# EasyEDA Pro project 平衡小车.eprj

# Schematic Schematic1
Create Date: 2024-09-21; Page Name: P1; Project Name: 平衡小车; Schematic Name: Schematic1; Update Date: 2024-09-22; Company: 嘉立创EDA; Page Size: A4; Version: V1.0
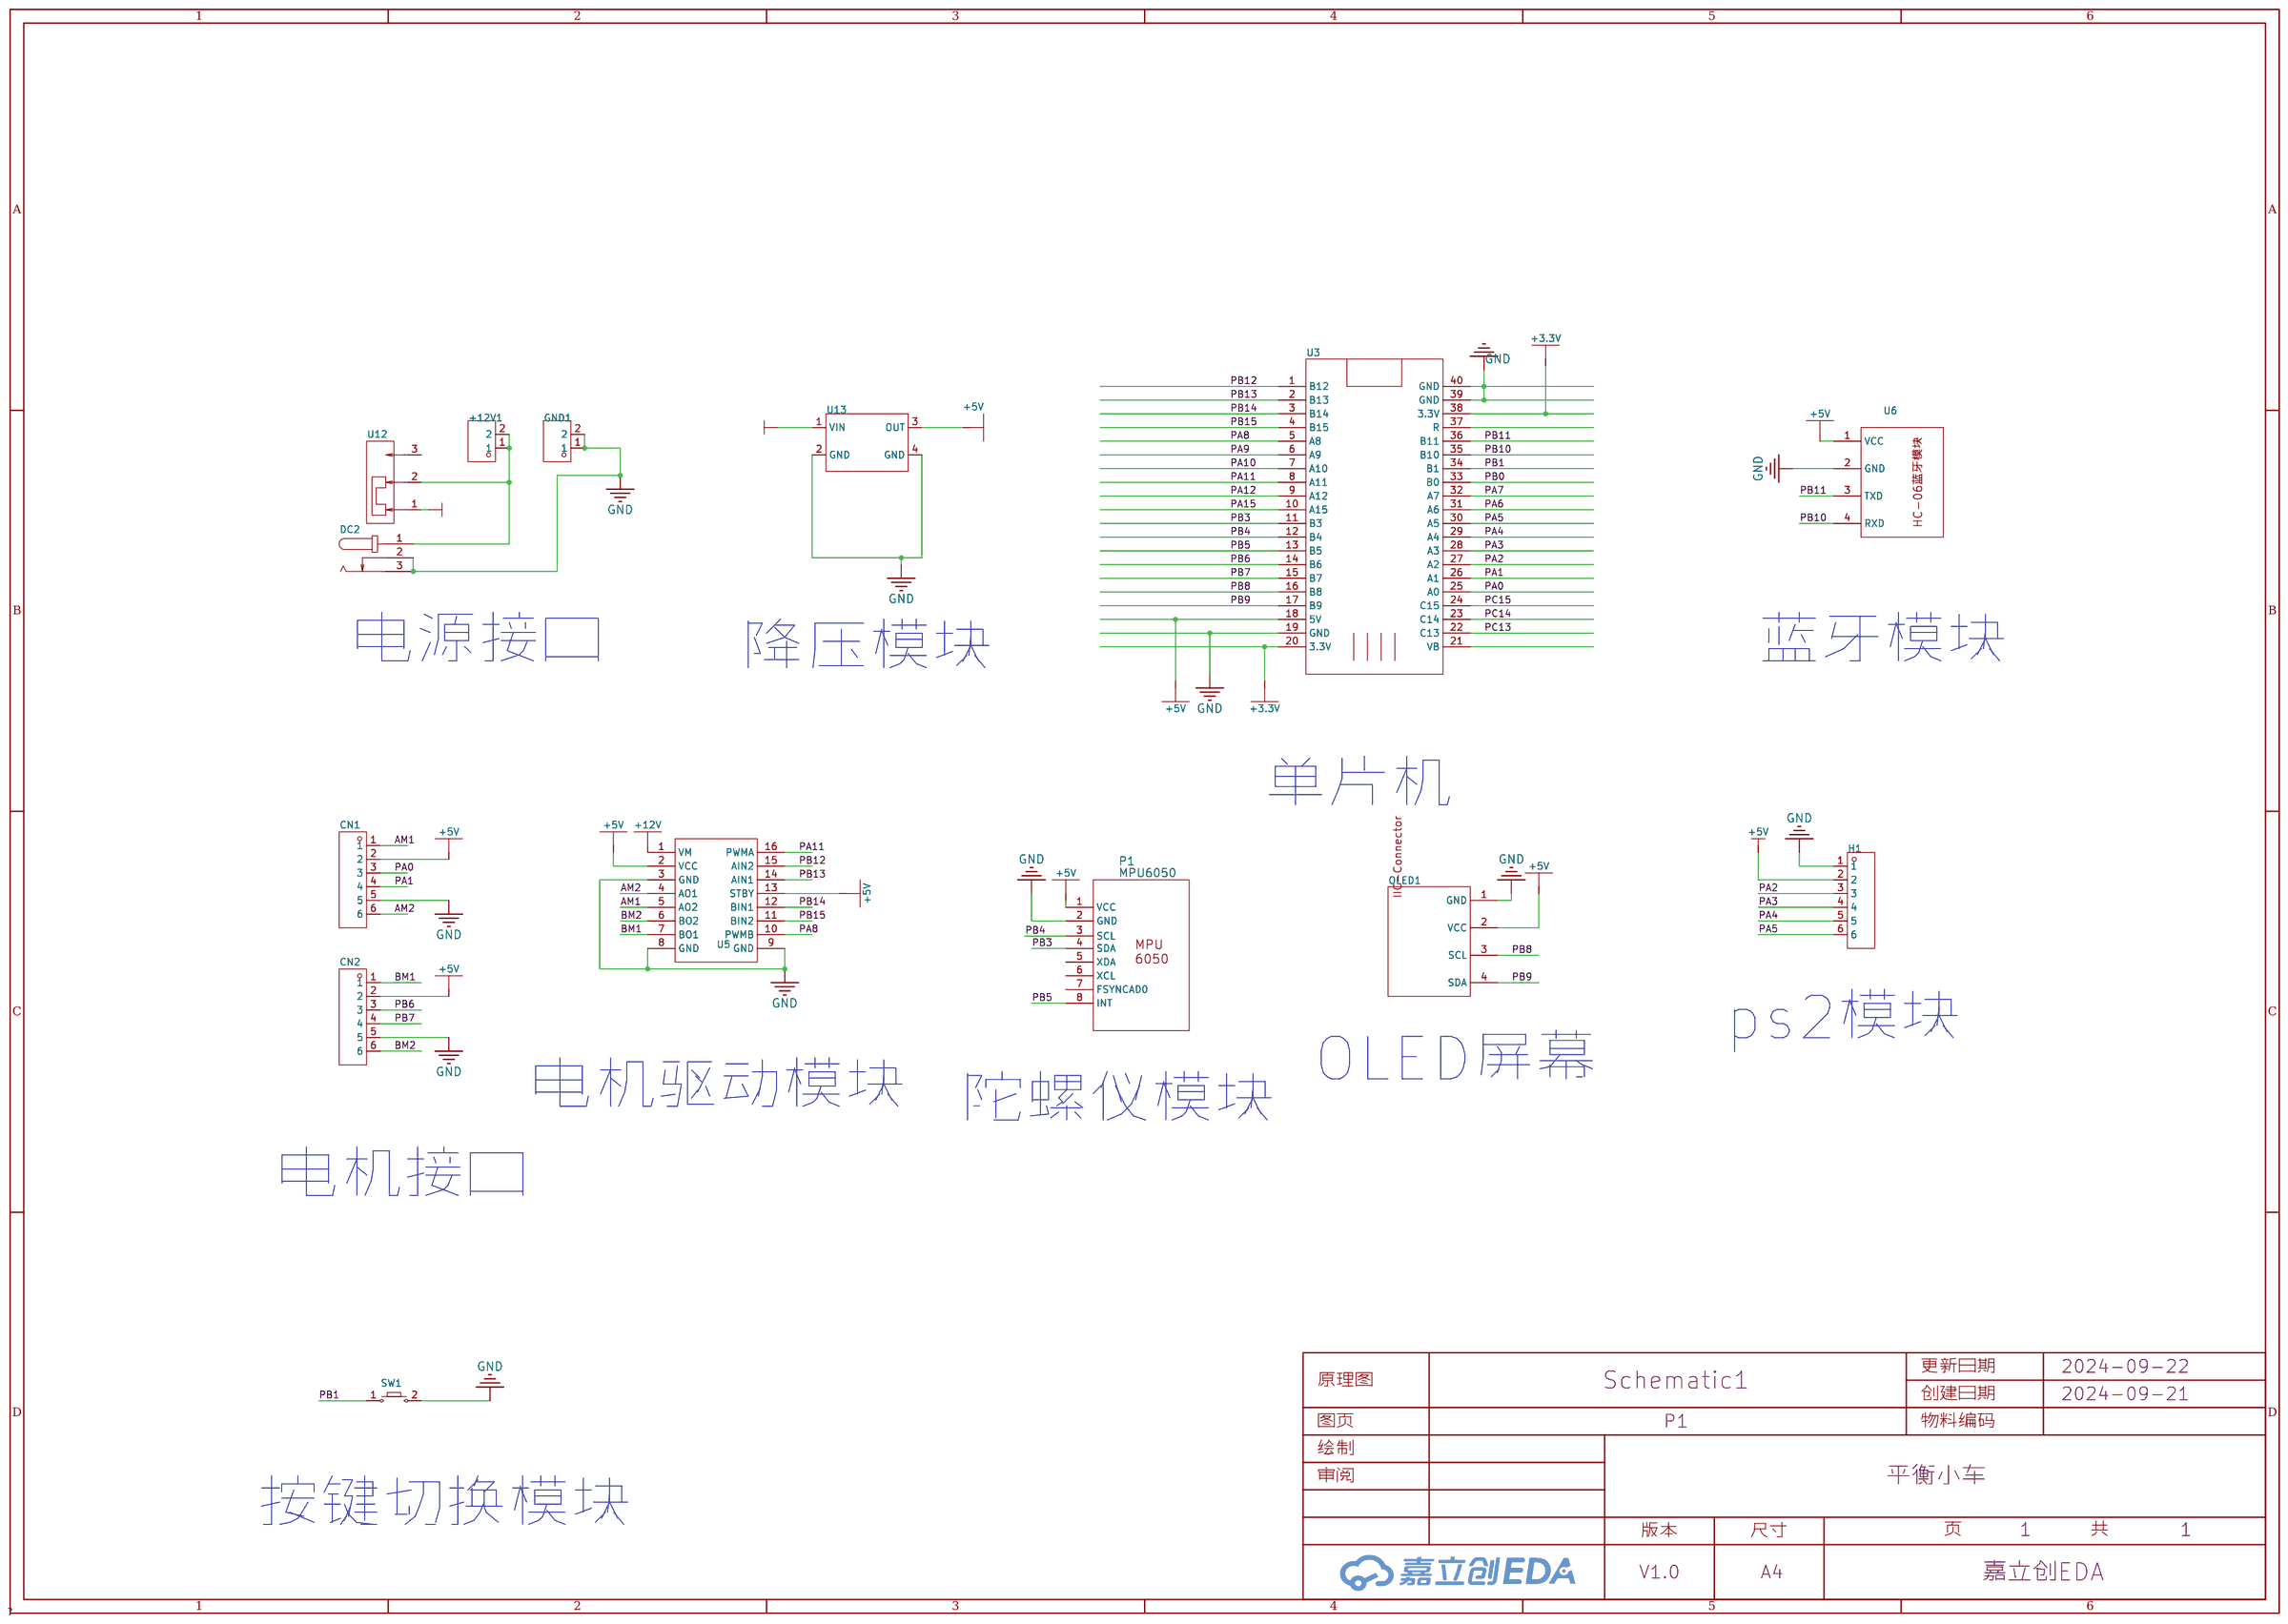
[diagram p0: schematic sheet]

## Parts
+12V1  -  [hdr-th_2p-p2.54-v]
CN1  PH2.0-6P  [ph2.0-6p 直针端子座]
CN2  PH2.0-6P  [ph2.0-6p 直针端子座]
DC2  -  [dc-in-th_kh-dc-005-2.5]
GND1  -  [hdr-th_2p-p2.54-v]
H1  PZ254V-11-06P  [HDR-TH_6P-P2.54-V-M]
OLED1  -  [0.96oled_4p]
P1  MPU6050  [mpu6050]
SW1  -  [Key_SMD_3x4x2]
U3  -  [stm32f103c8t6核心板]
U5  -  [tb6612fng module - 8pin x 2]
U6  蓝牙模块HC-06  [dip-1x4p2.54（hc-06蓝牙模块）]
U12  SS-12D10-G5  [SW-TH_SS-12D10-G050]
U13  -  [MP1584模块]

## Library data of the parts
+12V1 GND1 = 排针2P: 2.54 1*2P 直排针 0.8u镀金 PBT RoHS,针长3*6mm; Supplier Part: C152154; Manufacturer: Nextron(台湾正凌); Manufacturer Part: Z-211-0211-0021-001; LCSC On Sale: 1; Supplier Footprint: Through Hole,P=2.54mm; JLCPCB Part Class: Extended Part; JLCPCB Stock Number: 5280; Datasheet: https://atta.szlcsc.com/upload/public/pdf/source/20171225/C152154_15141883746031203216.pdf; Supplier: LCSC; Number of Positions: 2; Connector Type: 排针; Number of Rows: 1; Mounting Type: 通孔; Contact Type: 公形引脚; Pitch: 0.100; Contact Material: 黄铜
CN1 CN2 = PH2.0-6P: Pin Type: IN; Supplier: LCSC; Supplier Part: C722763; Manufacturer: CAX(创都); Manufacturer Part: PH2.0-4P; JLCPCB Part Class: Extended Part
DC2 = KH-DC-005-2.5: 连接器类型:DC电源插座;安装方式:弯插;触点内径:-;触点外径:6.4mm;额定电流:1A;额定电压:30V;工作温度范围:-25~+70;; LCSC Part Name: DC电源插座 外径:6.4mm; Supplier Part: C2847170; Manufacturer: kinghelm(金航标); Supplier Footprint: 插件; JLCPCB Part Class: Extended Part; Datasheet: https://atta.szlcsc.com/upload/public/pdf/source/20210716/C2847170_7F0110A0BEDEE81C68B76DF87AC8DA16.pdf; Supplier: LCSC; Connector Type: DC电源插座; Mounting Style: 弯插; Outside Contact Diameter: 6.4mm; Current Rating (Max): 1A; Voltage Rating (Max): 30V; Operating Temperature Range: -25~+70
H1 = PZ254V-11-06P: 插针结构:1x6P;间距:2.54mm;行距:-;圆针/方针:方针;安装类型:直插;排数:单排;总PIN位数:6P;额定电流:-;额定电压:-;配合针长度:6mm;塑高:2.5mm;端接针长度:3mm;触头材质:黄铜;触头镀层:-;工作温度范围:-40℃~+105℃;颜色:黑色;; LCSC Part Name: 间距:2.54mm 1x6P 直插 方针; Supplier Part: C492405; Manufacturer: XFCN(兴飞); Supplier Footprint: 插件,P=2.54mm; JLCPCB Part Class: 扩展库; Datasheet: https://atta.szlcsc.com/upload/public/pdf/source/20200309/C492405_597F1930F5B55CC3C7FD95458F1C3977.pdf; Supplier: LCSC; Pin Structure: 1x6P; Pitch: 2.54mm; Circluar Pins/Square Pins: 方针; Mounting Type: 直插; Number of Rows: 单排; Number of Pins: 6P; Length of Mating Pin: 6mm; Insulation Height: 2.5mm; Length of End Connection Pin: 3mm; Contact Material: 黄铜; Operating Temperature Range: -40℃~+105℃; Color: 黑色
OLED1 = 0.96OLED_4P: LCSC Part Name: 0.96OLED_4P_MODULE_JX; Supplier Part: C9900004566; Manufacturer Part: 0.96OLED_4P_MODULE_JX; Supplier Footprint: THrough hole; JLCPCB Part Class: Extended Part; Supplier: LCSC
P1 = MPU6050
SW1 = Key_SMD_3x4x2: Supplier Footprint: SMD
U3 = stm32f103c8t6最小系统板
U5 = TB6612FNG模块: Pin Type: In
U6 = 蓝牙模块HC-06: Pin Type: IN
U12 = SS-12D10-G5: 电路结构:单刀双掷;安装方式:直插;开关颜色:黑色;滑钮形状:矩形柱状;引脚样式:PC引脚;开关长度:12.7mm;开关宽度:6.7mm;开关高度:11.3mm;; LCSC Part Name: 插件大电流拨动开关; Supplier Part: C2998777; Manufacturer: DEALON(德艺隆); Supplier Footprint: 插件; JLCPCB Part Class: Extended Part; Datasheet: https://atta.szlcsc.com/upload/public/pdf/source/20220428/E10CB334ACBAF32CF4AF8D87DA871CD3.pdf; Supplier: LCSC; Circuit: 单刀双掷; Mounting Style: 直插; Actuator Color: 黑色; Actuator Style: 矩形柱状; Pin Style: PC引脚; Switch Length: 12.7mm; Switch Width: 6.7mm; Switch Height: 11.3mm
U13 = MP1584模块: Pin Type: IN

## Nets
+3.3V: U3.20(3.3V) U3.38(3.3V)
+5V: CN1.2 CN2.2 H1.2 OLED1.2(VCC) P1.1(VCC) U3.18(5V) U5.2(VCC) U5.13(STBY) U6.1(VCC) U13.3(OUT)
+12V: U5.1(VM) U12.1 U13.1(VIN)
GND: CN1.5 CN2.5 DC2.2 DC2.3 GND1.1 GND1.2 H1.1 OLED1.1(GND) P1.2(GND) SW1.2 U3.19(GND) U3.39(GND) U3.40(GND) U5.3(GND) U5.8(GND) U5.9(GND) U6.2(GND) U13.2(GND) U13.4(GND)
AM1: CN1.1 U5.5(AO2)
AM2: CN1.6 U5.4(AO1)
BM1: CN2.1 U5.7(BO1)
BM2: CN2.6 U5.6(BO2)
PA0: CN1.3 U3.25(A0)
PA1: CN1.4 U3.26(A1)
PA2: H1.3 U3.27(A2)
PA3: H1.4 U3.28(A3)
PA4: H1.5 U3.29(A4)
PA5: H1.6 U3.30(A5)
PA6: U3.31(A6)
PA7: U3.32(A7)
PA8: U3.5(A8) U5.10(PWMB)
PA9: U3.6(A9)
PA10: U3.7(A10)
PA11: U3.8(A11) U5.16(PWMA)
PA12: U3.9(A12)
PA15: U3.10(A15)
PB0: U3.33(B0)
PB1: SW1.1 U3.34(B1)
PB3: P1.4(SDA) U3.11(B3)
PB4: P1.3(SCL) U3.12(B4)
PB5: P1.8(INT) U3.13(B5)
PB6: CN2.3 U3.14(B6)
PB7: CN2.4 U3.15(B7)
PB8: OLED1.3(SCL) U3.16(B8)
PB9: OLED1.4(SDA) U3.17(B9)
PB10: U3.35(B10) U6.4(RXD)
PB11: U3.36(B11) U6.3(TXD)
PB12: U3.1(B12) U5.15(AIN2)
PB13: U3.2(B13) U5.14(AIN1)
PB14: U3.3(B14) U5.12(BIN1)
PB15: U3.4(B15) U5.11(BIN2)
PC13: U3.22(C13)
PC14: U3.23(C14)
PC15: U3.24(C15)
$1N933: +12V1.1 +12V1.2 DC2.1 U12.2

Not connected (* = marked no-connect by the designer): P1 5(XDA) 6(XCL) 7(FSYNCAD0); U3 21(VB) 37(R); U12 3

## Notes on the sheet
- 电源接口
- 降压模块
- 蓝牙模块
- 单片机
- ps2模块
- OLED屏幕
- 电机驱动模块
- 陀螺仪模块
- 电机接口
- 按键切换模块

# Board PCB1
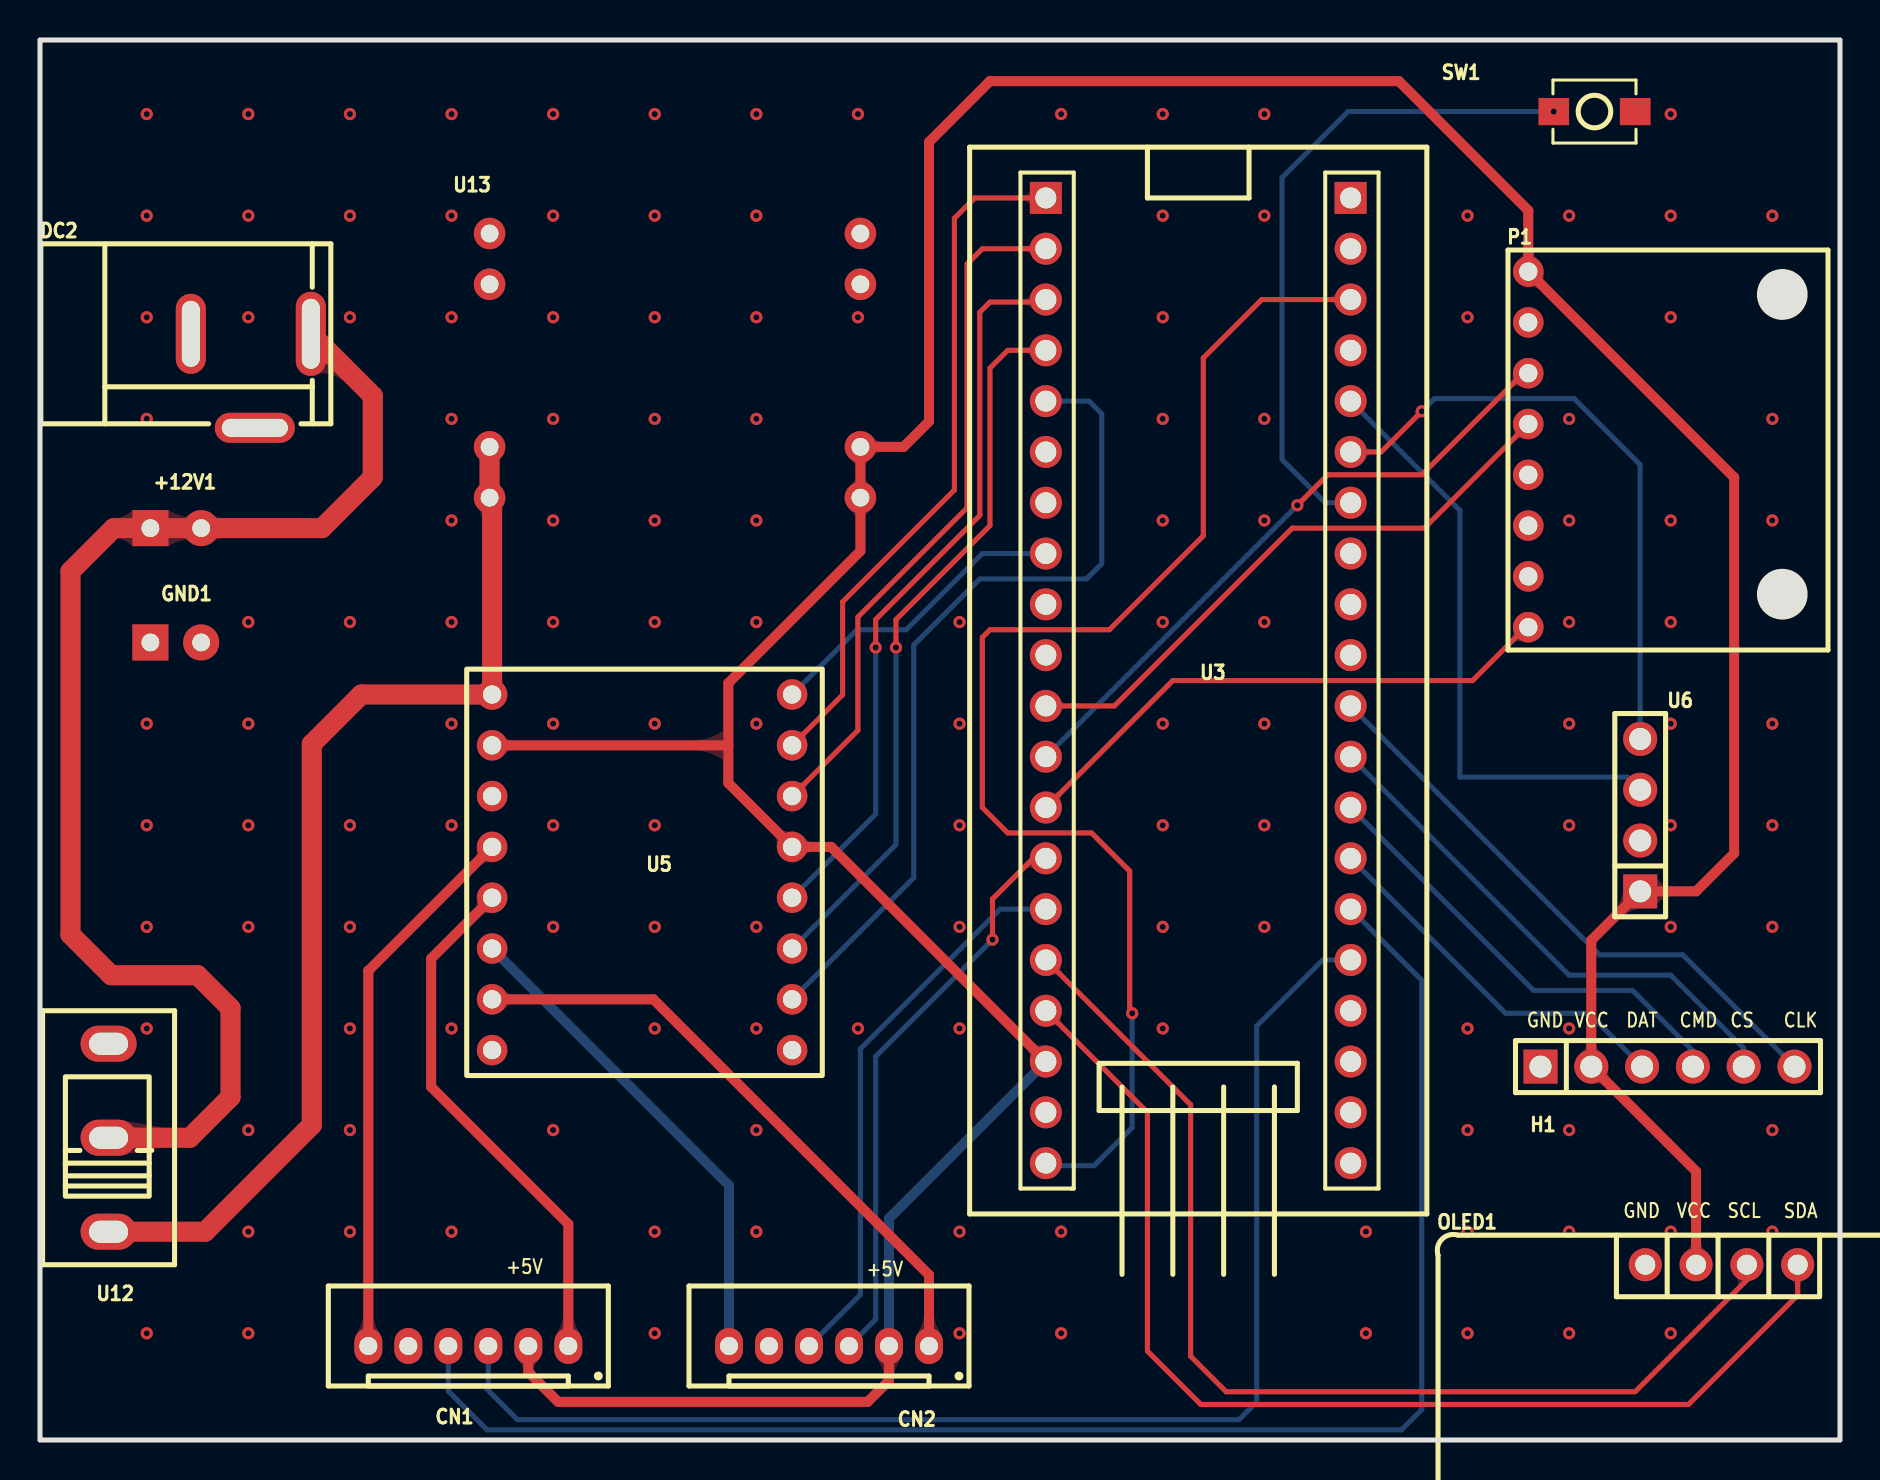
[diagram p1: board, top side]
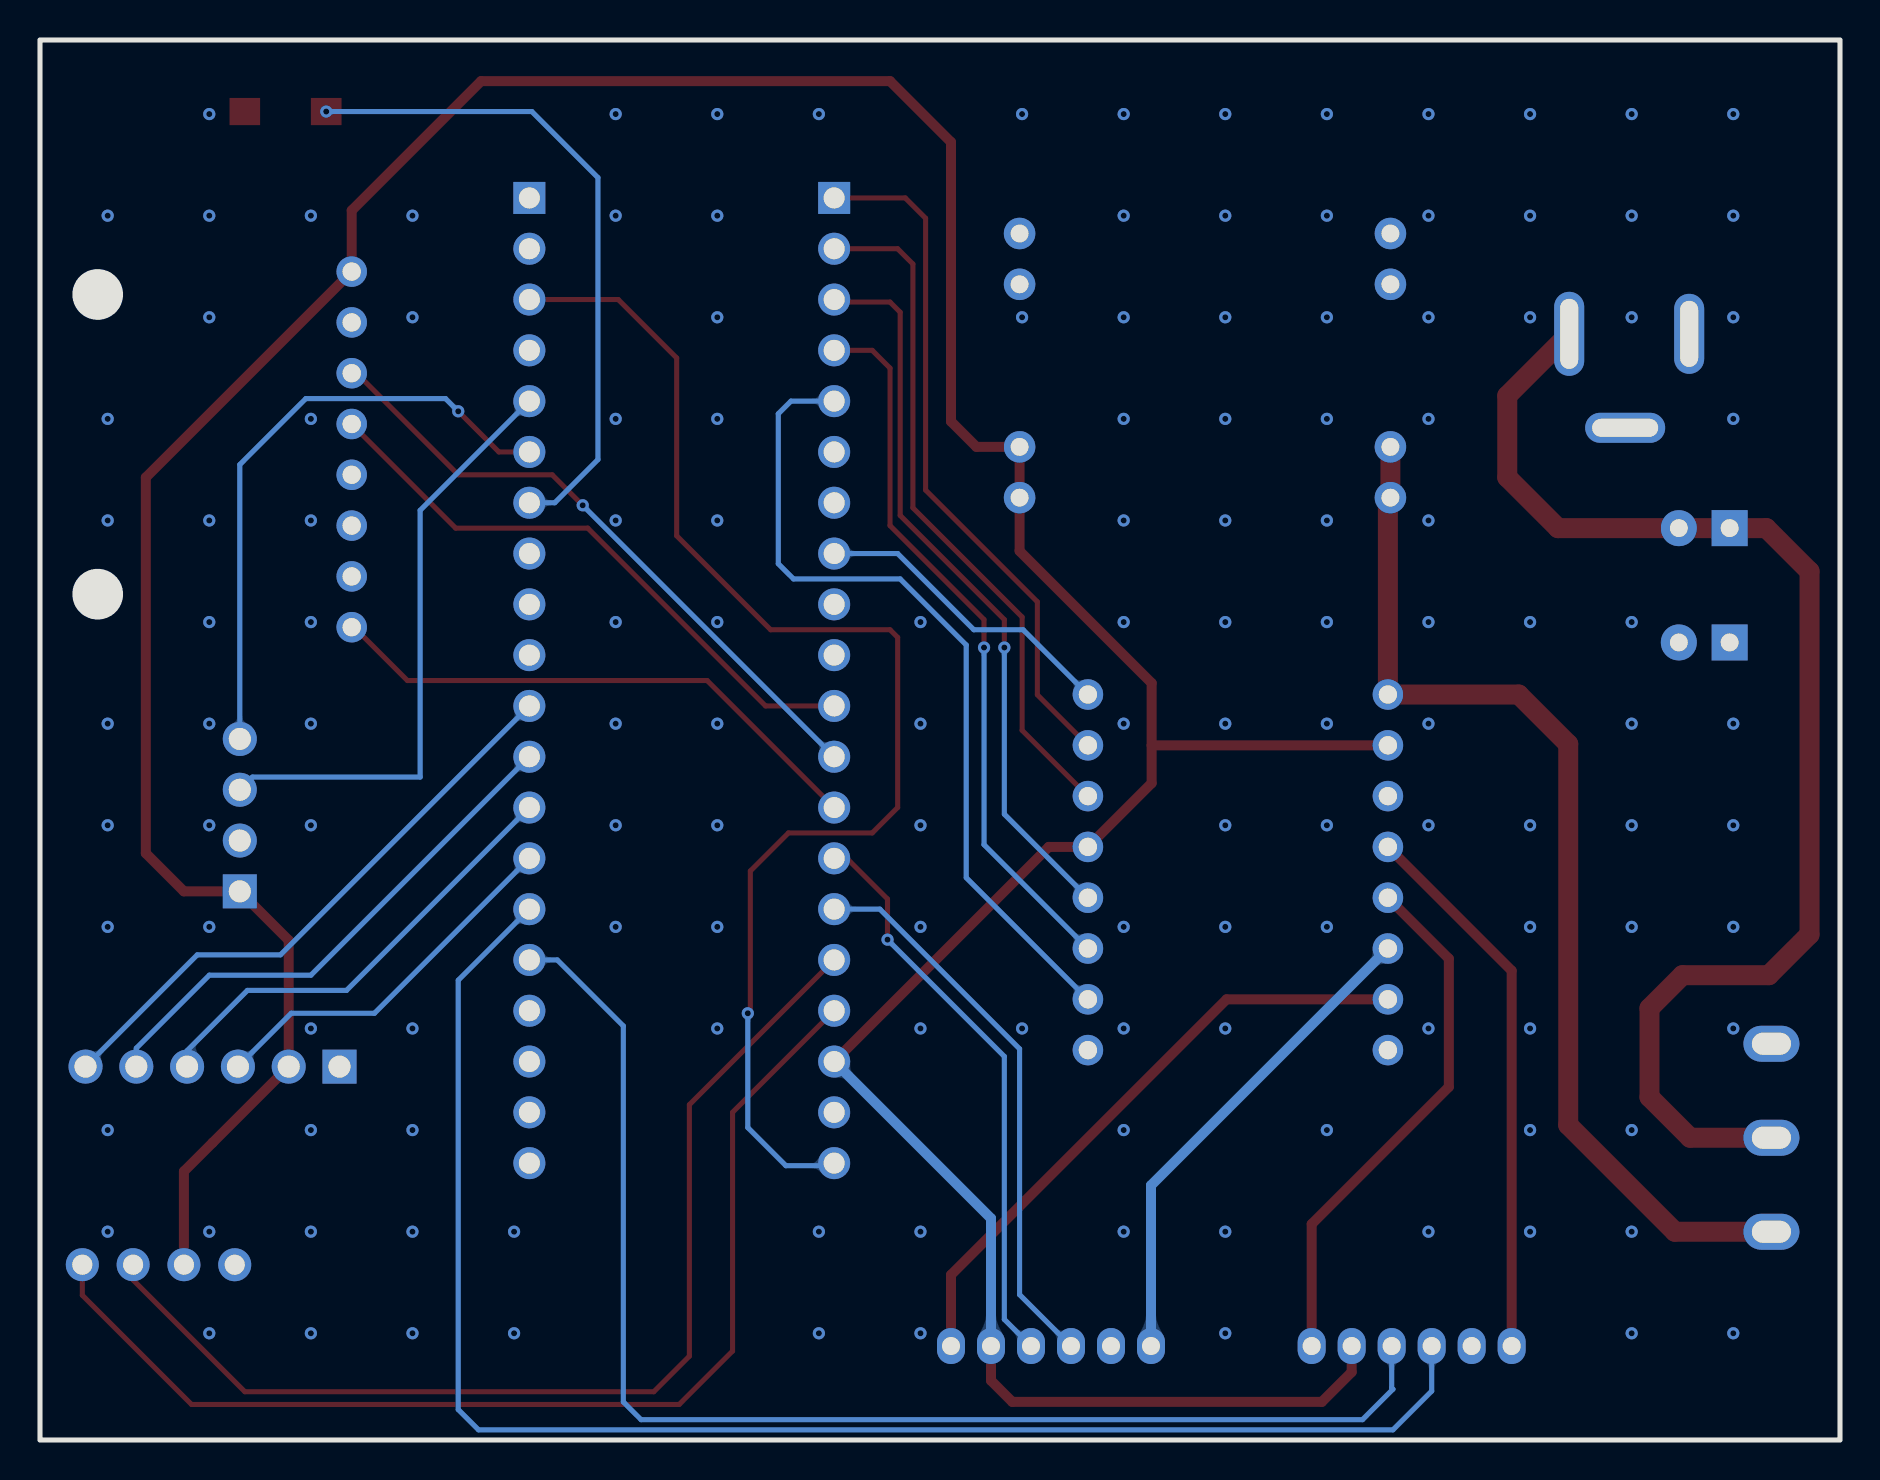
[diagram p2: board, bottom side, seen from below]

Outline 90 x 70 mm; copper layers: Top Layer, Bottom Layer. Coordinates in mm from the lower left corner of the outline.
Outline path: rectangle 0,70 90,0
Stack: Top Layer 0.035mm / Dielectric1 1.51mm FR4 er 4.5 / Bottom Layer 0.035mm

## Design rules (mm)
template: JLCPCB Capability(Two Layers Board)
spacing copperThickness1oz (default): track to track 0.102, other pairs 0.152 to 0.3
spacing copperThickness2oz: track to track 0.203, other pairs 0.152 to 0.3
track width copperThickness1oz (default): min 0.127, default 0.254, max 2.54
track width copperThickness2oz: min 0.203, default 0.254, max 2.54
differential pair differentialPair (default): width min 0.127, default 0.254, max 2.54; gap min 0.152, default 0.152
via viaSize (default): diameter min 0.5, default 0.61, max 10; hole min 0.3, default 0.305, max 6.3

## Placement (name value [footprint] x y rotation side)
+12V1  -  [hdr-th_2p-p2.54-v]  6.79 45.59 0 top
CN1  PH2.0-6P  [ph2.0-6p 直针端子座]  26.42 4.7 180 top
CN2  PH2.0-6P  [ph2.0-6p 直针端子座]  44.45 4.7 180 top
DC2  -  [dc-in-th_kh-dc-005-2.5]  10.54 52.96 0 top
GND1  -  [hdr-th_2p-p2.54-v]  6.79 39.88 0 top
H1  PZ254V-11-06P  [HDR-TH_6P-P2.54-V-M]  81.38 18.67 0 top
OLED1  -  [0.96oled_4p]  84.07 8.76 0 top
P1  MPU6050  [mpu6050]  73.4 39.5 0 top
SW1  -  [Key_SMD_3x4x2]  77.72 66.42 0 top
U3  -  [stm32f103c8t6核心板]  57.91 37.97 0 top
U5  -  [tb6612fng module - 8pin x 2]  30.22 28.38 0 top
U6  蓝牙模块HC-06  [dip-1x4p2.54（hc-06蓝牙模块）]  80.01 31.24 0 top
U12  SS-12D10-G5  [SW-TH_SS-12D10-G050]  3.43 15.11 90 top
U13  -  [MP1584模块]  31.75 53.72 0 top

## Footprints (pads in the part's own frame, mm; a bottom-side part is the same pattern mirrored in y, then rotated)
0.96oled_4p
  round 1.651 hole 1.001: 1(-3.81,0) 2(-1.27,0.003) 3(1.27,0.003) 4(3.81,0.003)
dc-in-th_kh-dc-005-2.5
  oval 1.501x4.201 hole 0.899x3.5: 1(2.999,2.349)
  oval 1.501x4 hole 0.899x3.3: 2(-2.999,2.349)
  oval 4x1.501 hole 3.3x0.899: 3(0.201,-2.349)
dip-1x4p2.54（hc-06蓝牙模块）
  rect 1.7x1.7 hole 1.1: 1(0,-3.81)
  round 1.7 hole 1.1: 2(0,-1.27) 3(0,1.27) 4(0,3.81)
hdr-th_2p-p2.54-v
  rect 1.801x1.801 hole 0.889: 1(-1.27,0)
  round 1.801 hole 0.889: 2(1.27,0)
HDR-TH_6P-P2.54-V-M
  rect 1.7x1.7 hole 1.1: 1(-6.35,0)
  round 1.7 hole 1.1: 2(-3.81,0) 3(-1.27,0) 4(1.27,0) 5(3.81,0) 6(6.35,0)
Key_SMD_3x4x2
  rect 1.53x1.36 smd: 1(-2.035,0) 2(2.035,0)
MP1584模块
  round 1.575 hole 0.889: 1(-9.271,-4.064) 1(-9.271,-6.604) 2(-9.271,6.604) 2(-9.271,4.064) 3(9.271,-4.064) 3(9.271,-6.604) 4(9.271,6.604) 4(9.271,4.064)
mpu6050
  round 1.524 hole 0.914: 1(1.016,18.923) 2(1.016,16.383) 3(1.016,13.843) 4(1.016,11.303) 5(1.016,8.763) 6(1.016,6.223) 7(1.016,3.683) 8(1.016,1.143)
ph2.0-6p 直针端子座
  oval 1.4x1.8 hole 0.9: 1(0,0) 2(2,0) 3(4,0) 4(6,0) 5(8,0) 6(10,0)
stm32f103c8t6核心板
  rect 1.6x1.6 hole 1.049: 1(-7.62,24.13) 40(7.62,24.13)
  round 1.6 hole 1.049: 2(-7.62,21.59) 3(-7.62,19.05) 4(-7.62,16.51) 5(-7.62,13.97) 6(-7.62,11.43) 7(-7.62,8.89) 8(-7.62,6.35) 9(-7.62,3.81) 10(-7.62,1.27) 11(-7.62,-1.27) 12(-7.62,-3.81) 13(-7.62,-6.35) 14(-7.62,-8.89) 15(-7.62,-11.43) 16(-7.62,-13.97) 17(-7.62,-16.51) 18(-7.62,-19.05) 19(-7.62,-21.59) 20(-7.62,-24.13) 21(7.62,-24.13) 22(7.62,-21.59) 23(7.62,-19.05) 24(7.62,-16.51) 25(7.62,-13.97) 26(7.62,-11.43) 27(7.62,-8.89) 28(7.62,-6.35) 29(7.62,-3.81) 30(7.62,-1.27) 31(7.62,1.27) 32(7.62,3.81) 33(7.62,6.35) 34(7.62,8.89) 35(7.62,11.43) 36(7.62,13.97) 37(7.62,16.51) 38(7.62,19.05) 39(7.62,21.59)
SW-TH_SS-12D10-G050
  oval 1.8x2.8 hole 1.1x1.95: 1(-4.7,0) 2(0,0) 3(4.7,0)
tb6612fng module - 8pin x 2
  round 1.524 hole 0.914: 1(-7.62,8.89) 2(-7.62,6.35) 3(-7.62,3.81) 4(-7.62,1.27) 5(-7.62,-1.27) 6(-7.62,-3.81) 7(-7.62,-6.35) 8(-7.62,-8.89) 9(7.38,-8.89) 10(7.38,-6.35) 11(7.38,-3.81) 12(7.38,-1.27) 13(7.38,1.27) 14(7.38,3.81) 15(7.38,6.35) 16(7.38,8.89)

## Nets
As in the schematic.

Pads without a net: P1 5 6 7; U12 3

## Via types
v1: diameter 0.61, hole 0.305, Top Layer to Bottom Layer, 7 vias
v2: diameter 0.61, hole 0.304, Top Layer to Bottom Layer, 138 vias

## Routing (per net, layer and track width the routed paths; a pad name or vN(x,y) marks a point on that pad's centre or on a via; arc(x,y) is an arc through that point)
+3.3V: length 65.8
  Top Layer w0.254: U3.38 61.09,57.02 58.17,54.1 58.17,45.21 53.47,40.51 47.5,40.51 47.12,40.13 47.12,31.62 48.39,30.35 52.58,30.35 54.48,28.45 54.48,21.46 v1(54.61,21.34)
  Bottom Layer w0.254: v1(54.61,21.34) 54.61,15.62 52.71,13.72 50.42,13.72 U3.20
+5V: length 208.2
  Top Layer w0.5: U3.18 39.56,29.65 U5.13 34.42,32.84 34.42,34.73 ; 34.42,34.73 U5.2 ; 34.42,34.73 34.42,37.85 41.02,44.45 41.02,49.66 43.18,49.66 44.45,50.93 44.45,64.9 47.5,67.94 67.94,67.94 74.41,61.47 P1.1 84.71,48.13 84.71,29.34 82.8,27.43 U6.1 77.56,24.99 H1.2 82.8,13.43 OLED1.2 ; CN1.2 24.42,3.4 25.91,1.91 41.38,1.91 42.45,2.97 CN2.2
  Bottom Layer w0.5: U3.18 42.45,11.08 CN2.2
+12V: length 53.9
  Top Layer w1: 22.48,49.66 U13.1 22.61,46.99 U5.1 16.07,37.27 13.59,34.8 13.59,15.75 8.25,10.41 U12.1
GND:
  vias: v2(5.34,66.3) v2(5.34,61.22) v2(5.34,56.14) v2(5.34,51.06) v2(5.34,35.82) v2(5.34,30.74) v2(5.34,25.66) v2(5.34,20.58) v2(5.34,5.34) v2(10.42,66.3) v2(10.42,61.22) v2(10.42,56.14) v2(10.42,40.9) v2(10.42,35.82) v2(10.42,30.74) v2(10.42,25.66) v2(10.42,15.5) v2(10.42,10.42) v2(10.42,5.34) v2(15.5,66.3) v2(15.5,61.22) v2(15.5,56.14) v2(15.5,40.9) v2(15.5,30.74) v2(15.5,25.66) v2(15.5,20.58) v2(15.5,15.5) v2(15.5,10.42) v2(20.58,66.3) v2(20.58,61.22) v2(20.58,56.14) v2(20.58,51.06) v2(20.58,45.98) v2(20.58,40.9) v2(20.58,35.82) v2(20.58,30.74) v2(20.58,20.58) v2(20.58,10.42) v2(25.66,66.3) v2(25.66,61.22) v2(25.66,56.14) v2(25.66,51.06) v2(25.66,45.98) v2(25.66,40.9) v2(25.66,35.82) v2(25.66,30.74) v2(25.66,25.66) v2(25.66,15.5) v2(30.74,66.3) v2(30.74,61.22) v2(30.74,56.14) v2(30.74,51.06) v2(30.74,45.98) v2(30.74,40.9) v2(30.74,35.82) v2(30.74,30.74) v2(30.74,25.66) v2(30.74,20.58) v2(30.74,10.42) v2(30.74,5.34) v2(35.82,66.3) v2(35.82,61.22) v2(35.82,56.14) v2(35.82,51.06) v2(35.82,45.98) v2(35.82,40.9) v2(35.82,35.82) v2(35.82,25.66) v2(35.82,20.58) v2(35.82,15.5) v2(35.82,10.42) v2(40.9,66.3) v2(40.9,56.14) v2(40.9,20.58) v2(45.98,40.9) v2(45.98,35.82) v2(45.98,30.74) v2(45.98,25.66) v2(45.98,20.58) v2(45.98,10.42) v2(45.98,5.34) v2(51.06,66.3) v2(51.06,10.42) v2(51.06,5.34) v2(56.14,66.3) v2(56.14,61.22) v2(56.14,56.14) v2(56.14,51.06) v2(56.14,45.98) v2(56.14,40.9) v2(56.14,35.82) v2(56.14,30.74) v2(56.14,25.66) v2(56.14,20.58) v2(61.22,66.3) v2(61.22,61.22) v2(61.22,51.06) v2(61.22,45.98) v2(61.22,40.9) v2(61.22,35.82) v2(61.22,30.74) v2(61.22,25.66) v2(66.3,10.42) v2(66.3,5.34) v2(71.38,61.22) v2(71.38,56.14) v2(71.38,20.58) v2(71.38,15.5) v2(71.38,10.42) v2(71.38,5.34) v2(76.46,61.22) v2(76.46,51.06) v2(76.46,45.98) v2(76.46,40.9) v2(76.46,35.82) v2(76.46,30.74) v2(76.46,20.58) v2(76.46,15.5) v2(76.46,10.42) v2(76.46,5.34) v2(81.54,66.3) v2(81.54,61.22) v2(81.54,56.14) v2(81.54,45.98) v2(81.54,40.9) v2(81.54,35.82) v2(81.54,30.74) v2(81.54,25.66) v2(81.54,10.42) v2(81.54,5.34) v2(86.62,61.22) v2(86.62,51.06) v2(86.62,45.98) v2(86.62,35.82) v2(86.62,30.74) v2(86.62,25.66) v2(86.62,15.5) v2(86.62,10.42)
AM1: length 26.5
  Top Layer w0.5: CN1.1 26.42,10.79 19.56,17.65 19.56,24.07 U5.5
AM2: length 27.5
  Top Layer w0.5: CN1.6 16.42,23.47 U5.4
BM1: length 31.1
  Top Layer w0.5: U5.7 30.67,22.03 44.45,8.25 CN2.1
BM2: length 24.8
  Bottom Layer w0.5: U5.6 34.45,12.73 CN2.6
PA0: length 66.5
  Bottom Layer w0.254: U3.25 64.13,24 60.83,20.7 60.83,1.91 59.94,1.02 23.88,1.02 22.35,2.54 22.42,2.6 CN1.3
PA1: length 78.6
  Bottom Layer w0.254: CN1.4 20.42,2.44 22.35,0.51 68.07,0.51 69.09,1.52 69.09,22.99 U3.26
PA2: length 18.9
  Bottom Layer w0.254: U3.27 73.28,21.34 77.44,21.34 H1.3
PA3: length 22.9
  Bottom Layer w0.254: H1.4 82.65,19.46 79.63,22.48 74.68,22.48 U3.28
PA4: length 26.6
  Bottom Layer w0.254: U3.29 76.45,23.24 81.53,23.24 85.19,19.59 H1.5
PA5: length 29.7
  Bottom Layer w0.254: H1.6 82.14,24.26 77.98,24.26 U3.30
PA8: length 41.9
  Bottom Layer w0.254: U5.10 43.69,28.12 43.69,39.75 46.99,43.05 52.32,43.05 53.09,43.81 53.09,51.31 52.45,51.94 U3.5
PA11: length 15.6
  Bottom Layer w0.254: U5.16 40.84,40.51 43.31,40.51 47.12,44.32 U3.8
PB1: length 33.4
  Bottom Layer w0.254: U3.34 64.26,46.86 62.1,49.02 62.1,63.12 65.41,66.42 v1(75.69,66.42)
PB3: length 30.3
  Top Layer w0.254: 74.68,51.05 69.22,45.59 62.61,45.59 53.72,36.7 U3.11
PB4: length 32.1
  Top Layer w0.254: P1.3 74.17,53.34 69.09,48.26 64.39,48.26 v1(62.87,46.74)
  Bottom Layer w0.254: U3.12 v1(62.87,46.74)
PB5: length 27.9
  Top Layer w0.254: U3.13 56.64,37.97 71.63,37.97 74.29,40.64 P1.8
PB6: length 28.8
  Top Layer w0.254: v1(47.62,25.02) 47.62,27.05 49.66,29.08 U3.14
  Bottom Layer w0.254: v1(47.62,25.02) 41.78,19.18 41.78,6.03 CN2.3
PB7: length 28.1
  Bottom Layer w0.254: CN2.4 41.02,7.27 41.02,19.56 48.01,26.54 U3.15
PB8: length 54.4
  Top Layer w0.254: U3.16 57.53,16.76 57.53,4.19 59.31,2.41 79.76,2.41 85.34,8 OLED1.3
PB9: length 56.5
  Top Layer w0.254: OLED1.4 87.88,7.24 82.42,1.78 58.04,1.78 55.37,4.44 55.37,16.38 U3.17
PB10: length 30.7
  Top Layer w0.254: 65.53,49.4 67.06,49.4 v1(69.09,51.44)
  Bottom Layer w0.254: U6.4 80.01,48.77 76.71,52.07 69.72,52.07 v1(69.09,51.44)
PB11: length 30.3
  Bottom Layer w0.254: U6.3 79.38,33.15 70.99,33.15 70.99,46.48 U3.36
PB12: length 34.7
  Top Layer w0.254: U3.1 46.74,62.1 45.72,61.09 45.72,47.5 40.13,41.91 40.13,37.26 U5.15
PB13: length 34.5
  Top Layer w0.254: U3.2 47.12,59.56 46.35,58.8 46.35,46.61 40.89,41.15 40.89,35.48 U5.14
PB14: length 36.7
  Top Layer w0.254: U3.3 50.16,56.9 47.5,56.9 46.99,56.39 46.99,46.23 41.78,41.02 v1(41.78,39.62)
  Bottom Layer w0.254: U5.12 41.78,31.29 v1(41.78,39.62)
PB15: length 36.3
  Top Layer w0.254: v1(42.8,39.62) 42.8,41.02 47.5,45.72 47.5,53.59 48.39,54.48 U3.4
  Bottom Layer w0.254: U5.11 42.8,29.77 v1(42.8,39.62)
$1N933: length 64.6
  Top Layer w1: U12.2 7.49,15.11 9.53,17.14 9.53,21.59 7.87,23.24 3.56,23.24 1.52,25.27 1.52,43.43 3.68,45.59 +12V1.1 +12V1.2 14.1,45.59 16.64,48.13 16.64,52.21 DC2.1

## Copper pours and planes (outline as drawn; the poured copper is in the pictures)
GND on Top Layer: 0.13,67.44 100.71,67.44 100.71,-14.73 0.13,-14.73
GND on Bottom Layer: -6.48,73.15 94.1,73.15 94.1,-8.76 -6.48,-8.76

Small or netless copper shapes (teardrops, artwork), in the pictures only: 61 on Top Layer, 38 on Bottom Layer

## Text on the board
Top Silkscreen Layer: +5V | GND | VCC | DAT | CMD | SCL | CS | CLK | SDA
